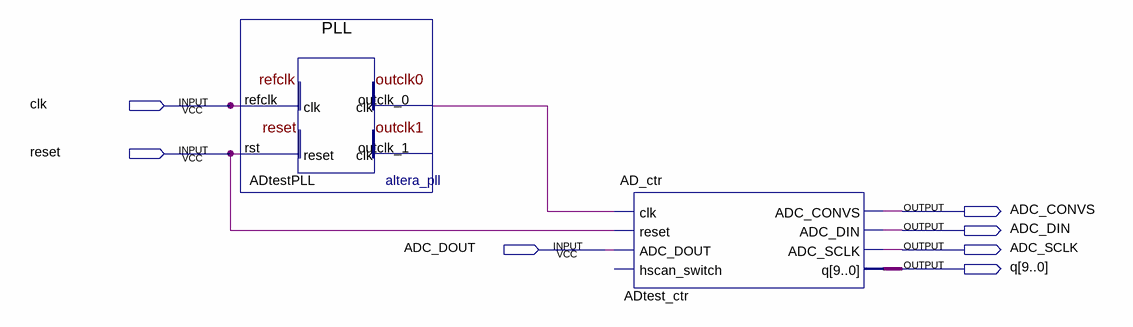
[diagram p0: schematic sheet]
// Quartus schematic ADtest.bdf as structural Verilog: 2 symbols, 7 pins
module ADtest (
  input  clk,
  input  reset,
  input  ADC_DOUT,
  output ADC_CONVS,
  output ADC_DIN,
  output ADC_SCLK,
  output [9:0] q
);

  wire ADtestPLL_outclk_0;

  PLL ADtestPLL (.refclk(clk), .rst(reset), .outclk_0(ADtestPLL_outclk_0));  // open: outclk_1
  AD_ctr ADtest_ctr (
    .clk(ADtestPLL_outclk_0), .reset(reset), .ADC_DOUT(ADC_DOUT), .ADC_CONVS(ADC_CONVS), .ADC_DIN(ADC_DIN),
    .ADC_SCLK(ADC_SCLK), .q(q));  // open: hscan_switch
endmodule
